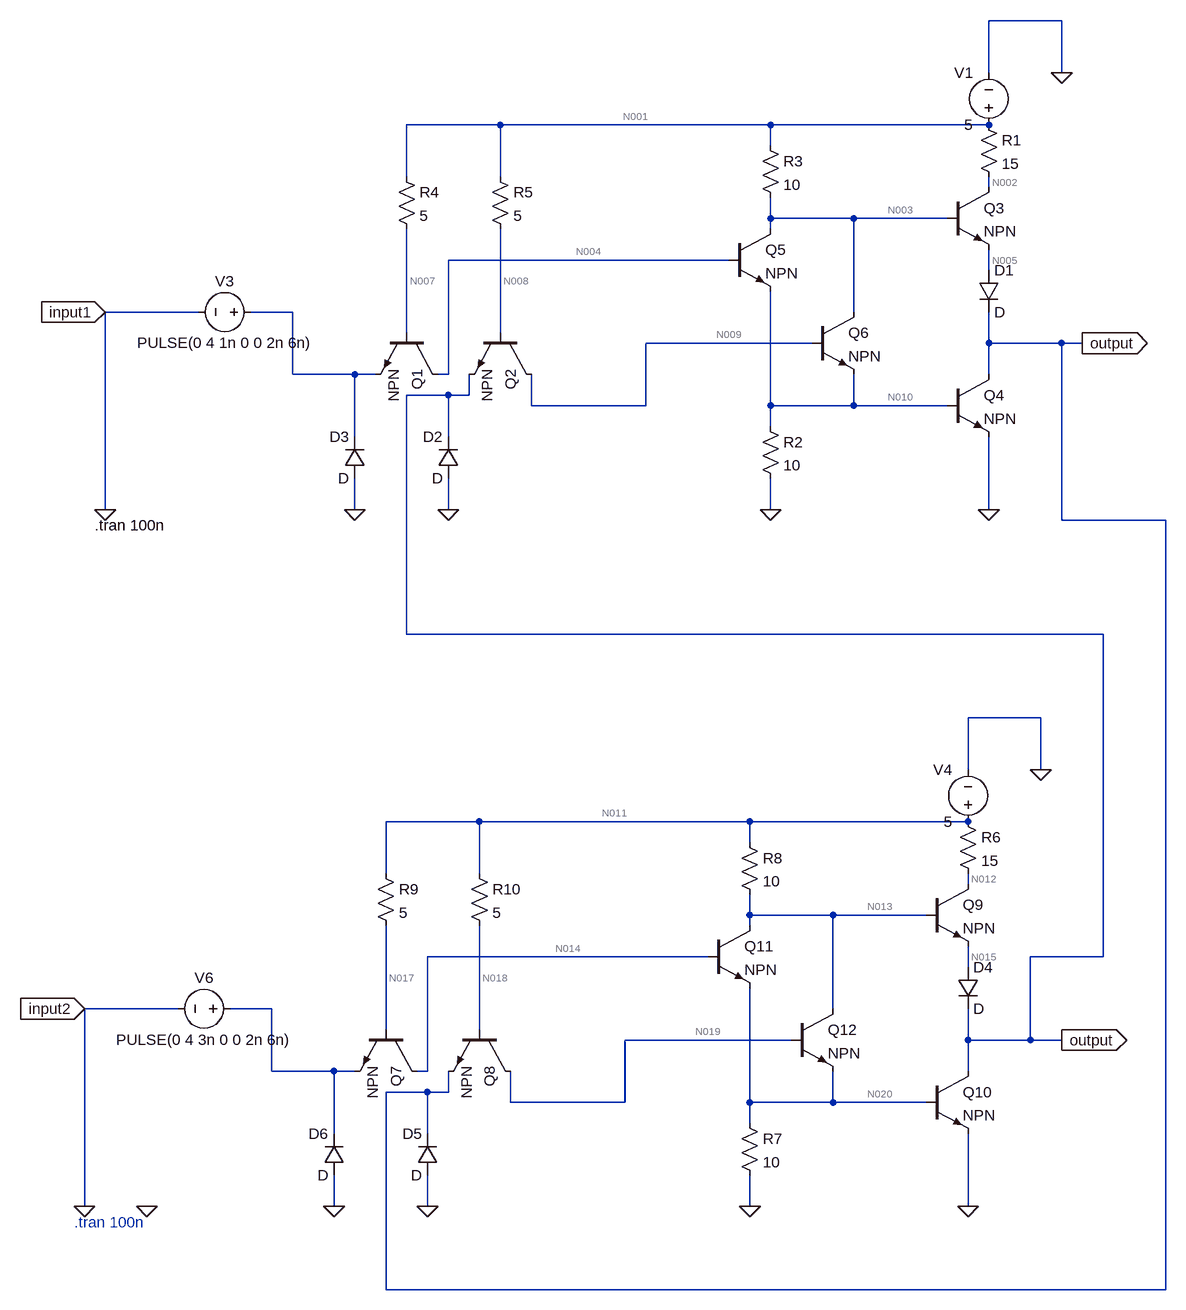
[diagram p0: schematic rs-ff-nor.asc]
rs-ff-nor.asc, the LTspice schematic file:
Version 4.1
SHEET 1 880 1908
WIRE 336 -48 224 -48
WIRE 224 32 224 -48
WIRE 336 32 336 -48
WIRE -528 112 -672 112
WIRE -112 112 -528 112
WIRE 224 112 -112 112
WIRE -112 144 -112 112
WIRE -672 192 -672 112
WIRE -528 192 -528 112
WIRE 224 208 224 192
WIRE -112 256 -112 224
WIRE 16 256 -112 256
WIRE 160 256 16 256
WIRE -112 272 -112 256
WIRE -176 320 -608 320
WIRE 224 336 224 304
WIRE -992 400 -1136 400
WIRE -848 400 -912 400
WIRE 16 400 16 256
WIRE -672 432 -672 272
WIRE -528 432 -528 272
WIRE -48 448 -304 448
WIRE 224 448 224 400
WIRE 336 448 224 448
WIRE 368 448 336 448
WIRE -848 496 -848 400
WIRE -752 496 -848 496
WIRE -720 496 -752 496
WIRE -608 496 -608 320
WIRE -608 496 -624 496
WIRE 224 496 224 448
WIRE -608 528 -672 528
WIRE -576 528 -576 496
WIRE -576 528 -608 528
WIRE -480 544 -480 496
WIRE -304 544 -304 448
WIRE -304 544 -480 544
WIRE -112 544 -112 368
WIRE 16 544 16 496
WIRE 16 544 -112 544
WIRE 160 544 16 544
WIRE -112 576 -112 544
WIRE -752 592 -752 496
WIRE -608 592 -608 528
WIRE -1136 704 -1136 400
WIRE -752 704 -752 656
WIRE -608 704 -608 656
WIRE -112 704 -112 656
WIRE 224 704 224 592
WIRE 336 720 336 448
WIRE 496 720 336 720
WIRE -672 896 -672 528
WIRE 400 896 -672 896
WIRE 304 1024 192 1024
WIRE 192 1104 192 1024
WIRE 304 1104 304 1024
WIRE -560 1184 -704 1184
WIRE -144 1184 -560 1184
WIRE 192 1184 -144 1184
WIRE -144 1216 -144 1184
WIRE -704 1264 -704 1184
WIRE -560 1264 -560 1184
WIRE 192 1280 192 1264
WIRE -144 1328 -144 1296
WIRE -16 1328 -144 1328
WIRE 128 1328 -16 1328
WIRE -144 1344 -144 1328
WIRE -208 1392 -640 1392
WIRE 400 1392 400 896
WIRE 400 1392 288 1392
WIRE 192 1408 192 1376
WIRE -1024 1472 -1168 1472
WIRE -880 1472 -944 1472
WIRE -16 1472 -16 1328
WIRE -704 1504 -704 1344
WIRE -560 1504 -560 1344
WIRE -80 1520 -336 1520
WIRE 192 1520 192 1472
WIRE 288 1520 288 1392
WIRE 288 1520 192 1520
WIRE 336 1520 288 1520
WIRE -880 1568 -880 1472
WIRE -784 1568 -880 1568
WIRE -752 1568 -784 1568
WIRE -640 1568 -640 1392
WIRE -640 1568 -656 1568
WIRE 192 1568 192 1520
WIRE -640 1600 -704 1600
WIRE -608 1600 -608 1568
WIRE -608 1600 -640 1600
WIRE -512 1616 -512 1568
WIRE -336 1616 -336 1520
WIRE -336 1616 -512 1616
WIRE -144 1616 -144 1440
WIRE -16 1616 -16 1568
WIRE -16 1616 -144 1616
WIRE 128 1616 -16 1616
WIRE -144 1648 -144 1616
WIRE -784 1664 -784 1568
WIRE -640 1664 -640 1600
WIRE -1168 1776 -1168 1472
WIRE -784 1776 -784 1728
WIRE -640 1776 -640 1728
WIRE -144 1776 -144 1728
WIRE 192 1776 192 1664
WIRE -704 1904 -704 1600
WIRE 496 1904 496 720
WIRE 496 1904 -704 1904
FLAG 336 32 0
FLAG 224 704 0
FLAG -112 704 0
FLAG -608 704 0
FLAG -752 704 0
FLAG -1136 704 0
FLAG 368 448 output
IOPIN 368 448 Out
FLAG 304 1104 0
FLAG 192 1776 0
FLAG -144 1776 0
FLAG -640 1776 0
FLAG -784 1776 0
FLAG -1072 1776 0
FLAG -1168 1776 0
FLAG 336 1520 output
IOPIN 336 1520 Out
FLAG -1136 400 input1
IOPIN -1136 400 In
FLAG -1168 1472 input2
IOPIN -1168 1472 In
SYMBOL voltage 224 128 R180
WINDOW 0 24 96 Left 2
WINDOW 3 24 16 Left 2
WINDOW 123 0 0 Left 0
WINDOW 39 0 0 Left 0
SYMATTR InstName V1
SYMATTR Value 5
SYMBOL npn -624 432 R90
SYMATTR InstName Q1
SYMBOL npn -480 432 R90
SYMATTR InstName Q2
SYMBOL npn 160 208 R0
SYMATTR InstName Q3
SYMBOL npn 160 496 R0
SYMATTR InstName Q4
SYMBOL res 208 96 R0
SYMATTR InstName R1
SYMATTR Value 15
SYMBOL res -128 560 R0
SYMATTR InstName R2
SYMATTR Value 10
SYMBOL diode 208 336 R0
SYMATTR InstName D1
SYMBOL diode -592 656 R180
WINDOW 0 24 64 Left 2
WINDOW 3 24 0 Left 2
SYMATTR InstName D2
SYMBOL diode -736 656 R180
WINDOW 0 24 64 Left 2
WINDOW 3 24 0 Left 2
SYMATTR InstName D3
SYMBOL voltage -896 400 R90
WINDOW 0 -32 56 VBottom 2
WINDOW 3 32 56 VTop 2
WINDOW 123 0 0 Left 0
WINDOW 39 0 0 Left 0
SYMATTR InstName V3
SYMATTR Value PULSE(0 4 1n 0 0 2n 6n)
SYMBOL res -128 128 R0
SYMATTR InstName R3
SYMATTR Value 10
SYMBOL res -688 176 R0
SYMATTR InstName R4
SYMATTR Value 5
SYMBOL res -544 176 R0
SYMATTR InstName R5
SYMATTR Value 5
SYMBOL npn -176 272 R0
SYMATTR InstName Q5
SYMBOL npn -48 400 R0
SYMATTR InstName Q6
SYMBOL voltage 192 1200 R180
WINDOW 0 24 96 Left 2
WINDOW 3 24 16 Left 2
WINDOW 123 0 0 Left 0
WINDOW 39 0 0 Left 0
SYMATTR InstName V4
SYMATTR Value 5
SYMBOL npn -656 1504 R90
SYMATTR InstName Q7
SYMBOL npn -512 1504 R90
SYMATTR InstName Q8
SYMBOL npn 128 1280 R0
SYMATTR InstName Q9
SYMBOL npn 128 1568 R0
SYMATTR InstName Q10
SYMBOL res 176 1168 R0
SYMATTR InstName R6
SYMATTR Value 15
SYMBOL res -160 1632 R0
SYMATTR InstName R7
SYMATTR Value 10
SYMBOL diode 176 1408 R0
SYMATTR InstName D4
SYMBOL diode -624 1728 R180
WINDOW 0 24 64 Left 2
WINDOW 3 24 0 Left 2
SYMATTR InstName D5
SYMBOL diode -768 1728 R180
WINDOW 0 24 64 Left 2
WINDOW 3 24 0 Left 2
SYMATTR InstName D6
SYMBOL voltage -928 1472 R90
WINDOW 0 -32 56 VBottom 2
WINDOW 3 32 56 VTop 2
WINDOW 123 0 0 Left 0
WINDOW 39 0 0 Left 0
SYMATTR InstName V6
SYMATTR Value PULSE(0 4 3n 0 0 2n 6n)
SYMBOL res -160 1200 R0
SYMATTR InstName R8
SYMATTR Value 10
SYMBOL res -720 1248 R0
SYMATTR InstName R9
SYMATTR Value 5
SYMBOL res -576 1248 R0
SYMATTR InstName R10
SYMATTR Value 5
SYMBOL npn -208 1344 R0
SYMATTR InstName Q11
SYMBOL npn -80 1472 R0
SYMATTR InstName Q12
TEXT -1152 728 Left 2 !.tran 100n
TEXT -1184 1800 Left 2 ;.tran 100n

The netlist it stands for:
* rs-ff-nor.asc
V1 N001 0 5
Q1 N004 N007 N006 0 NPN
Q2 N009 N008 output 0 NPN
Q3 N002 N003 N005 0 NPN
Q4 output N010 0 0 NPN
R1 N001 N002 15
R2 N010 0 10
D1 N005 output D
D2 0 output D
D3 0 N006 D
V3 N006 0 PULSE(0 4 1n 0 0 2n 6n)
R3 N001 N003 10
R4 N001 N007 5
R5 N001 N008 5
Q5 N003 N004 N010 0 NPN
Q6 N003 N009 N010 0 NPN
V4 N011 0 5
Q7 N014 N017 N016 0 NPN
Q8 N019 N018 output 0 NPN
Q9 N012 N013 N015 0 NPN
Q10 output N020 0 0 NPN
R6 N011 N012 15
R7 N020 0 10
D4 N015 output D
D5 0 output D
D6 0 N016 D
V6 N016 0 PULSE(0 4 3n 0 0 2n 6n)
R8 N011 N013 10
R9 N011 N017 5
R10 N011 N018 5
Q11 N013 N014 N020 0 NPN
Q12 N013 N019 N020 0 NPN
.model D D
.lib standard.dio
.model NPN NPN
.model PNP PNP
.lib standard.bjt
.tran 100n
* .tran 100n
.backanno
.end

* Results of the author's LTspice run, read from the files saved beside the schematic
* Operating Point, zero values left out:
*   V(n004) = 17.93 mV
*   V(n009) = 1.835 V
*   V(output) = 1.817 V
*   V(n005) = 2.61 V
*   V(n011) = 5 V
*   V(n014) = 17.93 mV
*   V(n012) = 2.654 V
*   V(n015) = 2.61 V
*   V(n001) = 5 V
*   V(n007) = 964.8 mV
*   V(n008) = 2.767 V
*   V(n002) = 2.654 V
*   V(n003) = 3.527 V
*   V(n010) = 941.7 mV
*   V(n017) = 964.8 mV
*   V(n019) = 1.835 V
*   V(n018) = 2.767 V
*   V(n013) = 3.527 V
*   V(n020) = 941.7 mV
*   I(R5) = 446.7 mA
*   I(D4) = 204.1 mA
*   Ic(Q12) = 99.68 mA
*   Ib(Q12) = 996.8 µA
*   Ie(Q12) = -100.7 mA
*   I(V1) = -1.558 A
*   Ic(Q2) = -996.8 µA
*   Ib(Q2) = 446.7 mA
*   Ie(Q2) = -445.7 mA
*   Ic(Q8) = -996.8 µA
*   Ib(Q8) = 446.7 mA
*   Ie(Q8) = -445.7 mA
*   I(R1) = 156.4 mA
*   I(V3) = 807 mA
*   I(V6) = 807 mA
*   I(R4) = 807 mA
*   Ic(Q10) = 649.8 mA
*   Ib(Q10) = 6.498 mA
*   Ie(Q10) = -656.3 mA
*   I(R9) = 807 mA
*   Ic(Q4) = 649.8 mA
*   Ib(Q4) = 6.498 mA
*   Ie(Q4) = -656.3 mA
*   I(D1) = 204.1 mA
*   Ic(Q6) = 99.68 mA
*   Ib(Q6) = 996.8 µA
*   Ie(Q6) = -100.7 mA
*   Ic(Q11) = 3.509 pA
*   Ib(Q11) = -4.433 pA
*   I(R2) = 94.17 mA
*   Ic(Q1) = 4.43 pA
*   Ib(Q1) = 807 mA
*   Ie(Q1) = -807 mA
*   Ic(Q5) = 3.509 pA
*   Ib(Q5) = -4.433 pA
*   Ic(Q7) = 4.43 pA
*   Ib(Q7) = 807 mA
*   Ie(Q7) = -807 mA
*   Ic(Q9) = 156.4 mA
*   Ib(Q9) = 47.67 mA
*   Ie(Q9) = -204.1 mA
*   I(R7) = 94.17 mA
*   I(R8) = 147.3 mA
*   I(R10) = 446.7 mA
*   I(R3) = 147.3 mA
*   I(R6) = 156.4 mA
*   Ic(Q3) = 156.4 mA
*   Ib(Q3) = 47.67 mA
*   Ie(Q3) = -204.1 mA
*   I(D2) = -1.827 pA
*   I(V4) = -1.558 A
*   I(D5) = -1.827 pA
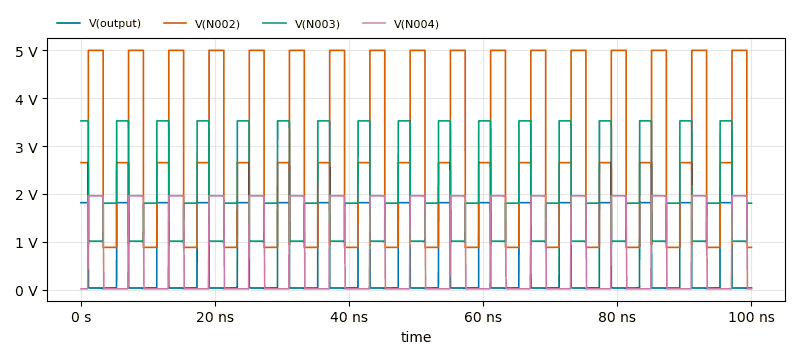
[diagram p1: Transient Analysis of rs-ff-nor.asc, plotted from the saved traces]
* Transient Analysis, 1 run:
*   V(output): min 25.86 mV, max 1.817 V, average 563.2 mV, rms 989 mV, last 35.84 mV
*   V(N002): min 880.8 mV, max 5 V, average 2.957 V, rms 3.427 V, last 883.5 mV
*   V(N003): min 998.5 mV, max 3.527 V, average 2.018 V, rms 2.267 V, last 1.806 V
*   V(N004): min 17.93 mV, max 1.963 V, average 778.8 mV, rms 1.221 V, last 17.93 mV